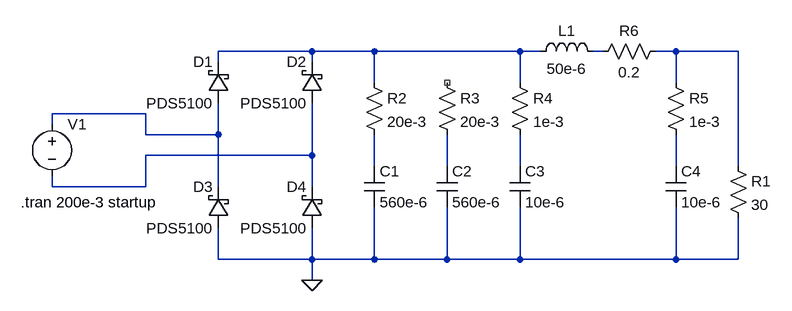
[diagram p0: schematic rectifier.asc]
rectifier.asc, the LTspice schematic file:
Version 4
SHEET 1 1080 680
WIRE 352 80 208 80
WIRE 448 80 352 80
WIRE 672 80 448 80
WIRE 704 80 672 80
WIRE 800 80 784 80
WIRE 912 80 880 80
WIRE 1008 80 912 80
WIRE 208 96 208 80
WIRE 352 96 352 80
WIRE 448 128 448 80
WIRE 672 128 672 80
WIRE 912 128 912 80
WIRE 96 176 -48 176
WIRE -48 192 -48 176
WIRE 96 208 96 176
WIRE 208 208 208 160
WIRE 208 208 96 208
WIRE 352 240 352 160
WIRE 352 240 96 240
WIRE 448 256 448 208
WIRE 560 256 560 208
WIRE 672 256 672 208
WIRE 912 256 912 208
WIRE 1008 256 1008 80
WIRE -48 288 -48 272
WIRE 96 288 96 240
WIRE 96 288 -48 288
WIRE 208 288 208 208
WIRE 352 288 352 240
WIRE 208 400 208 352
WIRE 352 400 352 352
WIRE 352 400 208 400
WIRE 448 400 448 320
WIRE 448 400 352 400
WIRE 560 400 560 320
WIRE 560 400 448 400
WIRE 672 400 672 320
WIRE 672 400 560 400
WIRE 912 400 912 320
WIRE 912 400 672 400
WIRE 1008 400 1008 336
WIRE 1008 400 912 400
WIRE 352 432 352 400
FLAG 352 432 0
SYMBOL schottky 224 160 R180
WINDOW 0 24 64 Left 2
WINDOW 3 24 0 Left 2
SYMATTR InstName D1
SYMATTR Value PDS5100
SYMATTR Description Diode
SYMATTR Type diode
SYMBOL cap 432 256 R0
SYMATTR InstName C1
SYMATTR Value 560e-6
SYMBOL cap 544 256 R0
SYMATTR InstName C2
SYMATTR Value 560e-6
SYMBOL ind 688 96 R270
WINDOW 0 32 56 VTop 2
WINDOW 3 5 56 VBottom 2
SYMATTR InstName L1
SYMATTR Value 50e-6
SYMBOL cap 656 256 R0
SYMATTR InstName C3
SYMATTR Value 10e-6
SYMBOL res 992 240 R0
SYMATTR InstName R1
SYMATTR Value 30
SYMBOL voltage -48 176 R0
WINDOW 3 24 96 Invisible 2
WINDOW 123 0 0 Left 0
WINDOW 39 0 0 Left 0
SYMATTR Value SINE(0 34 50)
SYMATTR InstName V1
SYMBOL cap 896 256 R0
SYMATTR InstName C4
SYMATTR Value 10e-6
SYMBOL schottky 368 160 R180
WINDOW 0 24 64 Left 2
WINDOW 3 24 0 Left 2
SYMATTR InstName D2
SYMATTR Value PDS5100
SYMATTR Description Diode
SYMATTR Type diode
SYMBOL schottky 224 352 R180
WINDOW 0 24 64 Left 2
WINDOW 3 24 0 Left 2
SYMATTR InstName D3
SYMATTR Value PDS5100
SYMATTR Description Diode
SYMATTR Type diode
SYMBOL schottky 368 352 R180
WINDOW 0 24 64 Left 2
WINDOW 3 24 0 Left 2
SYMATTR InstName D4
SYMATTR Value PDS5100
SYMATTR Description Diode
SYMATTR Type diode
SYMBOL res 432 112 R0
SYMATTR InstName R2
SYMATTR Value 20e-3
SYMBOL res 544 112 R0
SYMATTR InstName R3
SYMATTR Value 20e-3
SYMBOL res 656 112 R0
SYMATTR InstName R4
SYMATTR Value 1e-3
SYMBOL res 896 112 R0
SYMATTR InstName R5
SYMATTR Value 1e-3
SYMBOL res 896 64 R90
WINDOW 0 0 56 VBottom 2
WINDOW 3 32 56 VTop 2
SYMATTR InstName R6
SYMATTR Value 0.2
TEXT -96 312 Left 2 !.tran 200e-3 startup

The netlist it stands for:
* rectifier.asc
D1 N004 N001 PDS5100
C1 N006 0 560e-6
C2 N007 0 560e-6
L1 N001 N002 50e-6
C3 N008 0 10e-6
R1 N003 0 30
V1 N004 N005 SINE(0 34 50)
C4 N009 0 10e-6
D2 N005 N001 PDS5100
D3 0 N004 PDS5100
D4 0 N005 PDS5100
R2 N001 N006 20e-3
R3 NC_01 N007 20e-3
R4 N001 N008 1e-3
R5 N003 N009 1e-3
R6 N003 N002 0.2
.model D D
.lib standard.dio
.tran 200e-3 startup
.backanno
.end